# EAGLE schematic Battery Monitor (EAGLE 7.7.0)
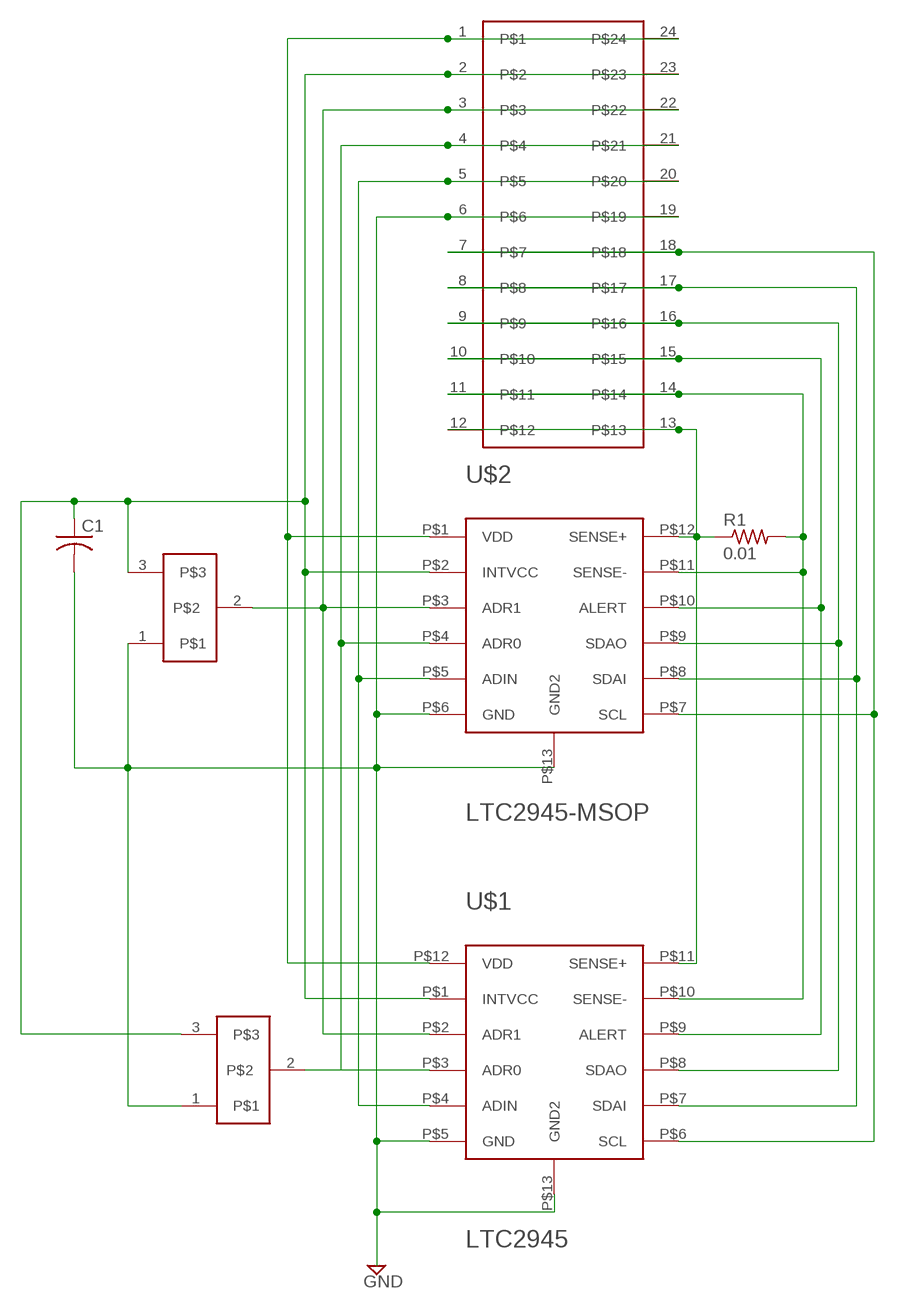
[diagram p0: schematic, sheet 1]

## Parts
C1  C-USC1812  [C1812]
R1  0.01  R-US_R2010  [R2010]
U$1  LTC2945  [QFN12]
U$2  LTC2945-MSOP  [MSOP12]
U$3  24-PINEVAL  [DIL24-6]
U$4  JUMP-3  [JUMP-3]
U$5  JUMP-3  [JUMP-3]

## Nets
N$1: C1.2 U$1.P$5(GND) U$1.P$13(GND2) U$2.P$6(GND) U$2.P$13(GND2) U$3.6 U$3.19 U$4.1 U$5.1
N$2: C1.1 U$1.P$1(INTVCC) U$2.P$2(INTVCC) U$3.2 U$3.23 U$4.3 U$5.3
N$3: U$1.P$12(VDD) U$2.P$1(VDD) U$3.1 U$3.24
N$4: U$1.P$2(ADR1) U$2.P$3(ADR1) U$3.3 U$3.22 U$4.2
N$5: U$1.P$3(ADR0) U$2.P$4(ADR0) U$3.4 U$3.21 U$5.2
N$6: U$1.P$4(ADIN) U$2.P$5(ADIN) U$3.5 U$3.20
N$7: U$1.P$6(SCL) U$2.P$7(SCL) U$3.7 U$3.18
N$8: U$1.P$8(SDAO) U$2.P$9(SDAO) U$3.9 U$3.16
N$9: R1.1 U$1.P$11(SENSE+) U$2.P$12(SENSE+) U$3.12 U$3.13
N$10: U$1.P$9(ALERT) U$2.P$10(ALERT) U$3.10 U$3.15
N$11: R1.2 U$1.P$10(SENSE-) U$2.P$11(SENSE-) U$3.11 U$3.14
N$14: U$1.P$7(SDAI) U$2.P$8(SDAI) U$3.8 U$3.17

## Library data of the parts
C1 = resistor:C-US: CAPACITOR, American symbol
R1 = resistor:R-US_: RESISTOR, American symbol
U$1 = Raj:LTC2945: LTC2945 Wide Range I2C Power Monitor
U$2 = Raj:LTC2945-MSOP
U$3 = Raj:24-PINEVAL
U$4 U$5 = Raj:JUMP-3